# EAGLE design main-pcb-v3-r (EAGLE 9.6.2)
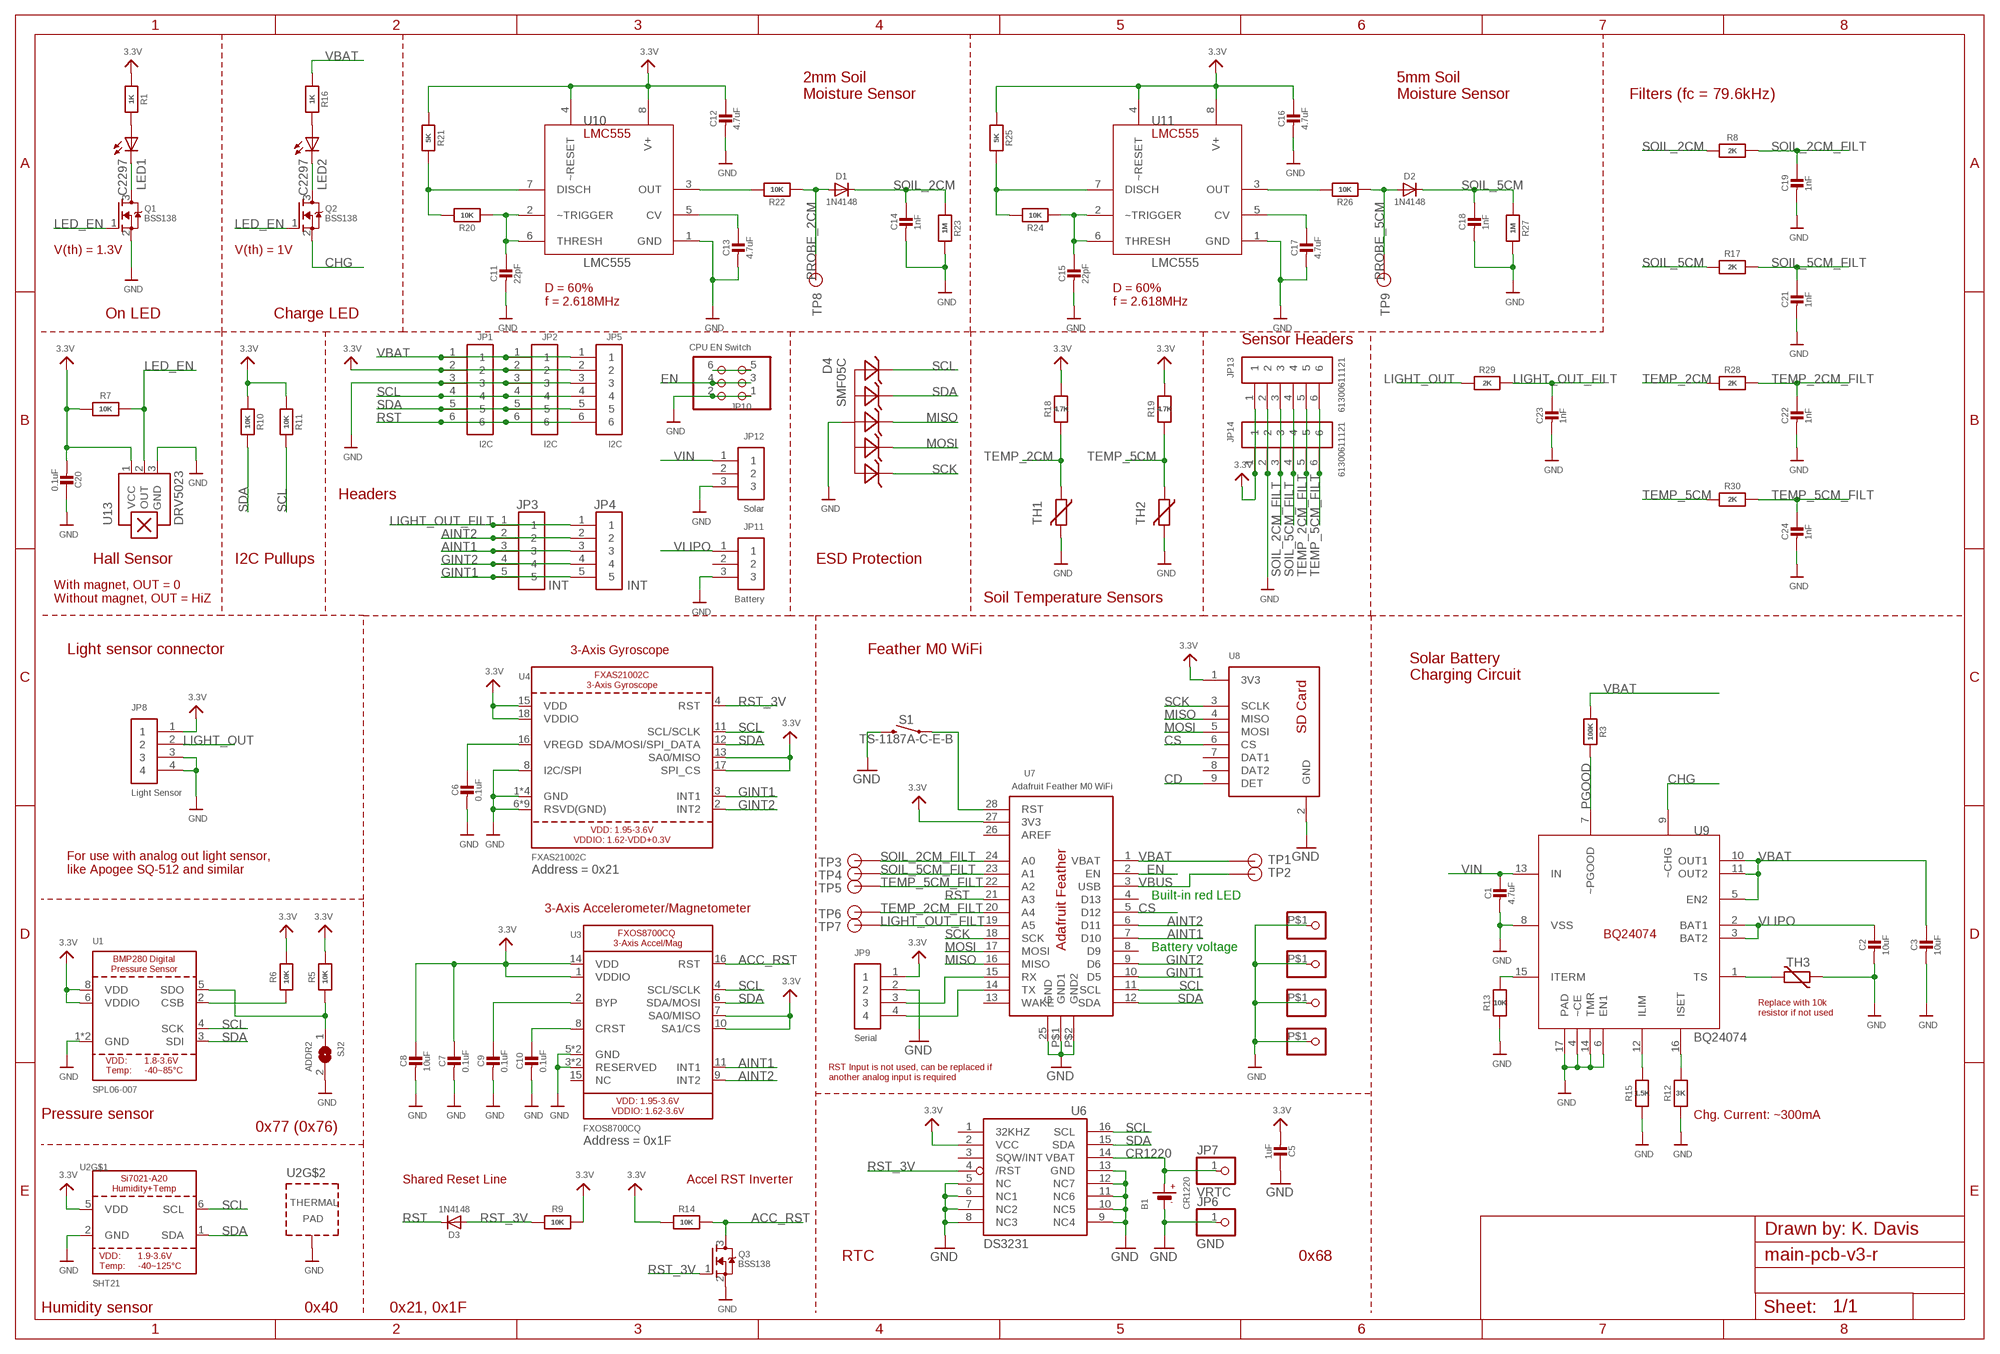
[diagram p0: schematic, sheet 1]

## Parts
B1  CR1220  BATTERYCR1220_2  [CR1220-2]
C1  4.7uF  CAP_CERAMIC0805-NOOUTLINE  [0805-NO]
C2  10uF  CAP_CERAMIC0805-NOOUTLINE  [0805-NO]
C3  10uF  CAP_CERAMIC0805-NOOUTLINE  [0805-NO]
C5  1uF  CAP_CERAMIC0805-NOOUTLINE  [0805-NO]
C6  0.1uF  CAP_CERAMIC0805-NOOUTLINE  [0805-NO]
C7  0.1uF  CAP_CERAMIC0805-NOOUTLINE  [0805-NO]
C8  10uF  CAP_CERAMIC0805-NOOUTLINE  [0805-NO]
C9  0.1uF  CAP_CERAMIC0805-NOOUTLINE  [0805-NO]
C10  0.1uF  CAP_CERAMIC0805-NOOUTLINE  [0805-NO]
C11  22pF  CAP_CERAMIC0805-NOOUTLINE  [0805-NO]
C12  4.7uF  CAP_CERAMIC0805-NOOUTLINE  [0805-NO]
C13  4.7uF  CAP_CERAMIC0805-NOOUTLINE  [0805-NO]
C14  1nF  CAP_CERAMIC0805-NOOUTLINE  [0805-NO]
C15  22pF  CAP_CERAMIC0805-NOOUTLINE  [0805-NO]
C16  4.7uF  CAP_CERAMIC0805-NOOUTLINE  [0805-NO]
C17  4.7uF  CAP_CERAMIC0805-NOOUTLINE  [0805-NO]
C18  1nF  CAP_CERAMIC0805-NOOUTLINE  [0805-NO]
C19  1nF  CAP_CERAMIC0805-NOOUTLINE  [0805-NO]
C20  0.1uF  CAP_CERAMIC0805-NOOUTLINE  [0805-NO]
C21  1nF  CAP_CERAMIC0805-NOOUTLINE  [0805-NO]
C22  1nF  CAP_CERAMIC0805-NOOUTLINE  [0805-NO]
C23  1nF  CAP_CERAMIC0805-NOOUTLINE  [0805-NO]
C24  1nF  CAP_CERAMIC0805-NOOUTLINE  [0805-NO]
D1  1N4148  DIODESOD-323  [SOD-323]
D2  1N4148  DIODESOD-323  [SOD-323]
D3  1N4148  DIODESOD-323  [SOD-323]
D4  SMF05C  [SC70-6]
JP1  I2C  61300611121  [61300611121]
JP2  I2C  61300611121  [61300611121]
JP3  INT  61300511121  [61300511121]
JP4  INT  61300511121  [61300511121]
JP5  I2C  61300611121  [61300611121]
JP6  GND  HEADER-1X1ROUND  [1X01_ROUND]
JP7  VRTC  HEADER-1X1ROUND  [1X01_ROUND]
JP8  Light Sensor  61300411121  [61300411121]
JP9  Serial  61300411121  [61300411121]
JP10  CPU EN Switch  PINHD-2X3  [2X03]
JP11  Battery  61300311121  [61300311121]
JP12  Solar  61300311121  [61300311121]
JP13  61300611121  [61300611121]
JP14  61300611121  [61300611121]
LED1  C2297  LEDCHIPLED_0805  [CHIPLED_0805]
LED2  C2297  LEDCHIPLED_0805  [CHIPLED_0805]
Q1  BSS138  MOSFET-NWIDE  [SOT23-WIDE]
Q2  BSS138  MOSFET-NWIDE  [SOT23-WIDE]
Q3  BSS138  MOSFET-NWIDE  [SOT23-WIDE]
R1  1K  RESISTOR_0603_NOOUT  [0603-NO]
R3  100K  RESISTOR_0603_NOOUT  [0603-NO]
R5  10K  RESISTOR_0603_NOOUT  [0603-NO]
R6  10K  RESISTOR_0603_NOOUT  [0603-NO]
R7  10K  RESISTOR_0603_NOOUT  [0603-NO]
R8  2K  RESISTOR_0603_NOOUT  [0603-NO]
R9  10K  RESISTOR0805_NOOUTLINE  [0805-NO]
R10  10K  RESISTOR_0603_NOOUT  [0603-NO]
R11  10K  RESISTOR_0603_NOOUT  [0603-NO]
R12  3K  RESISTOR0805_NOOUTLINE  [0805-NO]
R13  10K  RESISTOR0805_NOOUTLINE  [0805-NO]
R14  10K  RESISTOR0805_NOOUTLINE  [0805-NO]
R15  1.5K  RESISTOR0805_NOOUTLINE  [0805-NO]
R16  1K  RESISTOR_0603_NOOUT  [0603-NO]
R17  2K  RESISTOR_0603_NOOUT  [0603-NO]
R18  4.7K  RESISTOR0805_NOOUTLINE  [0805-NO]
R19  4.7K  RESISTOR0805_NOOUTLINE  [0805-NO]
R20  10K  RESISTOR0805_NOOUTLINE  [0805-NO]
R21  5K  RESISTOR0805_NOOUTLINE  [0805-NO]
R22  10K  RESISTOR0805_NOOUTLINE  [0805-NO]
R23  1M  RESISTOR0805_NOOUTLINE  [0805-NO]
R24  10K  RESISTOR0805_NOOUTLINE  [0805-NO]
R25  5K  RESISTOR0805_NOOUTLINE  [0805-NO]
R26  10K  RESISTOR0805_NOOUTLINE  [0805-NO]
R27  1M  RESISTOR0805_NOOUTLINE  [0805-NO]
R28  2K  RESISTOR_0603_NOOUT  [0603-NO]
R29  2K  RESISTOR_0603_NOOUT  [0603-NO]
R30  2K  RESISTOR_0603_NOOUT  [0603-NO]
S1  TS-1187A-C-E-B  MOMENTARY-SWITCH-SPST-SMD-5.2MM  [TACTILE_SWITCH_SMD_5.2MM]
SJ2  ADDR2  SOLDERJUMPER  [SOLDERJUMPER_ARROW_NOPASTE]
TH1  VARISTORCN1206  [CT/CN1206]
TH2  VARISTORCN1206  [CT/CN1206]
TH3  VARISTORCN1206  [CT/CN1206]
TP1  TP  [TP_50MIL_CIRC]
TP2  TP  [TP_50MIL_CIRC]
TP3  TP  [TP_50MIL_CIRC]
TP4  TP  [TP_50MIL_CIRC]
TP5  TP  [TP_50MIL_CIRC]
TP6  TP  [TP_50MIL_CIRC]
TP7  TP  [TP_50MIL_CIRC]
TP8  TP  [TP_50MIL_CIRC]
TP9  TP  [TP_50MIL_CIRC]
U1  SPL06-007  BMP280_COMBO  [BMX280_COMBO]
U2  SHT21  SI7021-A20  [DFN6_3X3_SI]
U3  FXOS8700CQ  ACCEL_MAG_FXOS8700CQ  [QFN16_3MM_FREESCALE_5X3]
U4  FXAS21002C  GYRO_FXAS21002C  [QFN24_4MM_FREESCALE_7X5]
U6  DS3231/SO  [SO16W]
U7  Adafruit Feather M0 WiFi  FEATHER  [FEATHER]
U8  SDCARD2  [SDCARD2]
U9  BQ24074  [VQFN-16_3MM]
U10  LMC555  [SOIC-8]
U11  LMC555  [SOIC-8]
U13  DRV5023  [SOT-23]
U$1  MOUNTING  [MOUNTING]
U$17  MOUNTING  [MOUNTING]
U$19  MOUNTING  [MOUNTING]
U$21  MOUNTING  [MOUNTING]

## Nets
3.3V: C5.2 C7.1 C8.1 C12.1 C16.1 C20.2 JP1.2 JP2.2 JP5.2 JP8.1 JP9.1 JP13.1 JP14.1 R1.1 R5.2 R6.2 R7.1 R9.2 R10.1 R11.1 R14.1 R18.2 R19.2 R21.1 R25.1 U1.6(VDDIO) U1.8(VDD) U2.5(VDD) U3.1(VDDIO) U3.7(SA0/MISO) U3.10(SA1/CS) U3.14(VDD) U4.13(SA0/MISO) U4.15(VDD) U4.17(SPI_CS) U4.18(VDDIO) U6.2(VCC) U7.27(3V3) U8.1(3V3) U10.4(~RESET) U10.8(V+) U11.4(~RESET) U11.8(V+) U13.1(VCC)
ACC_RST: Q3.3(D) R14.2 U3.16(RST)
AINT1: JP3.3 JP4.3 U3.11(INT1) U7.7(D10)
AINT2: JP3.2 JP4.2 U3.9(INT2) U7.6(D11)
CD: U8.9(DET)
CHG: Q2.2(S) U9.9(~CHG)
CR1220: B1.+ JP7.1 U6.14(VBAT)
CS: U7.5(D12) U8.6(CS)
EN: JP10.3 JP10.4 U7.2(EN)
GINT1: JP3.5 JP4.5 U4.3(INT1) U7.10(D5)
GINT2: JP3.4 JP4.4 U4.2(INT2) U7.9(D6)
GND: B1.- C1.2 C2.2 C3.2 C5.1 C6.2 C7.2 C8.2 C9.2 C10.2 C11.2 C12.2 C13.2 C14.2 C15.2 C16.2 C17.2 C18.2 C19.2 C20.1 C21.2 C22.2 C23.2 C24.2 D4.2(A) JP1.3 JP2.3 JP5.3 JP6.1 JP8.3 JP8.4 JP9.2 JP10.1 JP10.2 JP11.3 JP12.3 JP13.2 JP14.2 Q1.2(S) Q3.2(S) R12.1 R13.1 R15.1 R23.2 R27.2 S1.3 SJ2.2 TH1.2 TH2.2 TH3.2 U1.1(GND) U1.7(GND) U2.2(GND) U2.PAD(TP) U3.3(RESERVED) U3.5(GND) U3.12(GND) U3.13(RESERVED) U4.1(GND) U4.5(GND) U4.6(RSVD(GND)) U4.7(RSVD(GND)) U4.8(I2C/SPI) U4.9(RSVD(GND)) U4.10(RSVD(GND)) U4.14(GND) U4.19(GND) U4.20(RSVD(GND)) U4.21(RSVD(GND)) U4.22(RSVD(GND)) U4.23(RSVD(GND)) U4.24(RSVD(GND)) U6.5(NC) U6.6(NC1) U6.7(NC2) U6.8(NC3) U6.9(NC4) U6.10(NC5) U6.11(NC6) U6.12(NC7) U6.13(GND) U7.25(GND) U7.P$1(GND1) U7.P$2(GND2) U8.2(GND) U9.4(~CE) U9.6(EN1) U9.8(VSS) U9.14(TMR) U9.17(PAD) U10.1(GND) U11.1(GND) U13.3(GND) U$1.P$1 U$17.P$1 U$19.P$1 U$21.P$1
ITERM: R13.2 U9.15(ITERM)
LED1: LED1.C Q1.3(D)
LED2: LED2.C Q2.3(D)
LED_EN: Q1.1(G) Q2.1(G) R7.2 U13.2(OUT)
LIGHT_OUT: JP8.2 R29.1
LIGHT_OUT_FILT: C23.1 JP3.1 JP4.1 R29.2 TP7.1(TP) U7.19(A5)
MISO: D4.4(C3) U7.16(MISO) U8.4(MISO)
MOSI: D4.5(C4) U7.17(MOSI) U8.5(MOSI)
N$1: LED1.A R1.2
N$3: R6.1 U1.2(CSB)
N$4: R5.1 SJ2.1 U1.5(SDO)
N$5: JP9.3 U7.15(RX)
N$6: JP10.5 JP10.6
N$9: JP9.4 U7.14(TX)
N$10: TH3.1 U9.1(TS)
N$11: S1.1 U7.28(RST)
N$12: C11.1 R20.1 U10.2(~TRIGGER) U10.6(THRESH)
N$13: LED2.A R16.2
N$14: R20.2 R21.2 U10.7(DISCH)
N$15: C13.1 U10.5(CV)
N$16: C15.1 R24.1 U11.2(~TRIGGER) U11.6(THRESH)
N$17: R12.2 U9.16(ISET)
N$18: R15.2 U9.12(ILIM)
N$19: R24.2 R25.2 U11.7(DISCH)
N$20: R22.2 U10.3(OUT)
N$21: C17.1 U11.5(CV)
N$22: R26.2 U11.3(OUT)
N$24: C6.1 U4.16(VREGD)
N$26: C9.1 U3.2(BYP)
N$27: C10.1 U3.8(CRST)
PGOOD: R3.2 U9.7(~PGOOD)
PROBE_2CM: D1.A R22.1 TP8.1(TP)
PROBE_5CM: D2.A R26.1 TP9.1(TP)
RST: D3.C JP1.6 JP2.6 JP5.6 U7.21(A3)
RST_3V: D3.A Q3.1(G) R9.1 U4.4(RST) U6.4(/RST)
SCK: D4.6(C5) U7.18(SCK) U8.3(SCLK)
SCL: D4.1(C1) JP1.4 JP2.4 JP5.4 R11.2 U1.4(SCK) U2.6(SCL) U3.4(SCL/SCLK) U4.11(SCL/SCLK) U6.16(SCL) U7.11(SCL)
SDA: D4.3(C2) JP1.5 JP2.5 JP5.5 R10.2 U1.3(SDI) U2.1(SDA) U3.6(SDA/MOSI) U4.12(SDA/MOSI/SPI_DATA) U6.15(SDA) U7.12(SDA)
SOIL_2CM: C14.1 D1.C R8.1 R23.1
SOIL_2CM_FILT: C19.1 JP13.3 JP14.3 R8.2 TP3.1(TP) U7.24(A0)
SOIL_5CM: C18.1 D2.C R17.1 R27.1
SOIL_5CM_FILT: C21.1 JP13.4 JP14.4 R17.2 TP4.1(TP) U7.23(A1)
TEMP_2CM: R18.1 R28.1 TH1.1
TEMP_2CM_FILT: C22.1 JP13.5 JP14.5 R28.2 TP6.1(TP) U7.20(A4)
TEMP_5CM: R19.1 R30.1 TH2.1
TEMP_5CM_FILT: C24.1 JP13.6 JP14.6 R30.2 TP5.1(TP) U7.22(A2)
VBAT: C3.1 JP1.1 JP2.1 JP5.1 R3.1 R16.1 TP1.1(TP) U7.1(VBAT) U9.5(EN2) U9.10(OUT1) U9.11(OUT2)
VBUS: TP2.1(TP) U7.3(USB)
VIN: C1.1 JP12.1 U9.13(IN)
VLIPO: C2.1 JP11.1 U9.2(BAT1) U9.3(BAT2)
Unconnected: JP11.2 JP12.2 U3.15(NC) U6.1(32KHZ) U6.3(SQW/INT) U7.4(D13) U7.8(D9) U7.13(WAKE) U7.26(AREF) U8.7(DAT1) U8.8(DAT2)

## Notes on the sheet
- 2mm Soil
  Moisture Sensor
- 5mm Soil
  Moisture Sensor
- Filters (fc = 79.6kHz)
- V(th) = 1.3V | V(th) = 1V
- D = 60%
  f = 2.618MHz
- D = 60%
  f = 2.618MHz
- On LED | Charge LED
- Sensor Headers
- Headers
- Hall Sensor | I2C Pullups | ESD Protection
- With magnet, OUT = 0
  Without magnet, OUT = HiZ
- Soil Temperature Sensors
- Light sensor connector | 3-Axis Gyroscope | Feather M0 WiFi
- Solar Battery
  Charging Circuit
- For use with analog out light sensor,
  like Apogee SQ-512 and similar
- Address = 0x21
- Built-in red LED
- 3-Axis Accelerometer/Magnetometer
- Battery voltage
- Replace with 10k
  resistor if not used
- RST Input is not used, can be replaced if
  another analog input is required
- Pressure sensor | Chg. Current: ~300mA
- 0x77 (0x76)
- Address = 0x1F
- Shared Reset Line | Accel RST Inverter
- Drawn by: K. Davis
- RTC | 0x68
- Humidity sensor | 0x40 | 0x21, 0x1F

## Library data of the parts
B1 = microbuilder:BATTERY: CR1220 SMT - Digikey: 3001K-ND CD2032 BAT-HLD-001 - Digikey: BAT-HLD-001-ND
C1-C3 C5-C24 = microbuilder:CAP_CERAMIC: Ceramic Capacitors For new designs, use the packages preceded by an '_' character since they are more reliable: The following footprints should be used on most boards: _0402 - Standard footprint for regular board layouts _0603 - Standard footprint for regular board layouts _0805 - Standard footprint for regular board layouts _1206 - Standard footprint for regular board layouts For extremely tight-pitch boards where space is at a premium, the following 'micro-pitch' footprints can be used (smaller pads, no silkscreen outline, etc.): _0402MP - Micro-pitch footprint for very dense/compact boards _0603MP - Micro-pitch footprint for very dense/compact boards _0805MP - Micro-pitch footprint for very dense/compact boards _1206MP - Micro-pitch footprint for very dense/compact boards
D1-D3 = microbuilder:DIODE: Diode SMA Model Volts Amps Type Vf Ir Digikey # Notes SSA34-E3 40V 3A Schottky 480mV @ 3A 200uA @ 40V SSA34-E3/61TGITR-ND CDBA120-G 20V 1A Schottky 500mV @ 1A 500uA @ 20V 641-1014-6-ND REEL MBRA210 10V 2A Schottky 350mV @ 2A 700uA @ 10V MBRA210LT3 SOD-123 Model Volts Amps Type Vf Ir Order # Notes BAT54T1G 30V 200mA Schottky 800mV @ 200mA 2uA @ 25V BAT54T1GOSTR-ND B0530W 30V 500mA Schottky 430mV @ 500mA 130uA @ 30V B0530W-FDICT-ND REEL MBR120 20V 1A Schottky 340mV @ 1A MBR120VLSFT1GOSCT-ND SOD-323 Model Volts Amps Type Vf Ir Order # Notes PMEG2005EJ 20V 500mA Schottky 355mV @ 500mA 568-4110-1-ND ZLLS410 10V 570mA Schottky 380mV @ 570mA ZLLS410CT-ND 1N4148WS 75V 150mA Silicon/Simple 1V 1N4148WSFSCT-ND REEL SOD-523 Model Volts Amps Type Vf Ir Order # Notes BAT54XV2 30V 200mA Schottky 0.8V @ 100mA BAT54XV2CT-ND TB751S 30V 30mA Schottky RB751S-40TE61CT-ND SOT23-R/W (R = Solder Paste/Reflow Ovens, W = Hand-Soldering) Model Volts Amps Type Vf Ir Order # Notes BAT54FILM 40V 300mA Schottky 497-7162-1-ND POWERDI-5 Model Volts Amps Type Vf Ir Order # Notes PDS560 60V 5A Schottky 670mV @ 5A 150uA @ 60V PDS560DICT-ND
D4 = TVS-Diode-SMF05C:SMF05C; AVAILABILITY: Unavailable; MF: ON Semiconductor; MP: SMF05C; PACKAGE: SOT-363 ON Semiconductor; PRICE: None
JP1 JP2 JP5 JP13 JP14 = EarthPodLib:61300611121: CONN HEADER VERT 5POS 2.54MM Manufacturer's datasheet <https://katalog.we-online.de/em/datasheet/6130xx11121.pdf>; CREATED_BY: PCBLayout.com; DIGI_KEY_PART_NUMBER: 732-5318-ND; MANUFACTURER: Wurth Electronics Inc.; MPN: 61300511121
JP3 JP4 = Headers:61300511121: CONN HEADER VERT 5POS 2.54MM Manufacturer's datasheet <https://katalog.we-online.de/em/datasheet/6130xx11121.pdf>; CREATED_BY: PCBLayout.com; DIGI_KEY_PART_NUMBER: 732-5318-ND; MANUFACTURER: Wurth Electronics Inc.; MPN: 61300511121
JP6 JP7 = microbuilder:HEADER-1X1: PIN HEADER
JP8 JP9 = Headers:61300411121: CONN HEADER VERT 4POS 2.54MM Manufacturer's datasheet <https://katalog.we-online.de/em/datasheet/6130xx11121.pdf>; CREATED_BY: PCBLayout.com; DIGI_KEY_PART_NUMBER: 732-5317-ND; MANUFACTURER: Wurth Electronics Inc.; MPN: 61300411121
JP10 = pinhead:PINHD-2X3: PIN HEADER
JP11 JP12 = Headers:61300311121: CONN HEADER VERT 3POS 2.54MM Manufacturer's datasheet <https://katalog.we-online.de/em/datasheet/6130xx11121.pdf>; CREATED_BY: PCBLayout.com; DIGI_KEY_PART_NUMBER: 732-5316-ND; MANUFACTURER: Wurth Electronics Inc.; MPN: 61300311121
LED1 LED2 = adafruit:LED: LED OSRAM: - CHIPLED LG R971, LG N971, LY N971, LG Q971, LY Q971, LO R971, LY R971 LH N974, LH R974 LS Q976, LO Q976, LY Q976 LO Q996 - Hyper CHIPLED LW Q18S LB Q993, LB Q99A, LB R99A - SideLED LS A670, LO A670, LY A670, LG A670, LP A670 LB A673, LV A673, LT A673, LW A673 LH A674 LY A675 LS A676, LA A676, LO A676, LY A676, LW A676 LS A679, LY A679, LG A679 - Hyper Micro SIDELED® LS Y876, LA Y876, LO Y876, LY Y876 LT Y87S - SmartLED LW L88C, LW L88S LB L89C, LB L89S, LG L890 LS L89K, LO L89K, LY L89K LS L896, LA L896, LO L896, LY L896 - TOPLED LS T670, LO T670, LY T670, LG T670, LP T670 LSG T670, LSP T670, LSY T670, LOP T670, LYG T670 LG T671, LOG T671, LSG T671 LB T673, LV T673, LT T673, LW T673 LH T674 LS T676, LA T676, LO T676, LY T676, LB T676, LH T676, LSB T676, LW T676 LB T67C, LV T67C, LT T67C, LS T67K, LO T67K, LY T67K, LW E67C LS E67B, LA E67B, LO E67B, LY E67B, LB E67C, LV E67C, LT E67C LW T67C LS T679, LY T679, LG T679 LS T770, LO T770, LY T770, LG T770, LP T770 LB T773, LV T773, LT T773, LW T773 LH T774 LS E675, LA E675, LY E675, LS T675 LS T776, LA T776, LO T776, LY T776, LB T776 LHGB T686 LT T68C, LB T68C - Hyper Mini TOPLED® LB M676 - Mini TOPLED Santana® LG M470 LS M47K, LO M47K, LY M47K Source: http://www.osram.convergy.de/
Q1-Q3 = microbuilder:MOSFET-N: N-Channel Mosfet LEGEND VDS: Voltage Drain-Source ID: Drain Current RDS(ON): Drain-Source On-State Resistance VGS(TH): Gate-Source Threshold Voltage CISS: Drain-Source Input Capacitance SOT-23 Name VDS ID RDS(ON) VGS(TH) CISS Order Number 2N7002E 60V 260mA 2.5 Ohm 2.5V @ 250uA 26.7pF @ 25V 2N7002ET1GOSTR-ND BSH103 30V 850mA 400 mOhm 400mV @ 1mA 83pF @ 24V BSH103,235-ND BSS138 60V 320mA 1.6 Ohm 1.5V @ 250uA 50pF @ 10V Mouser: 771-BSS138PW115 DMN2075U-7 20V 4.2A 38 mOhm 1V @ 250 uA 594.3pF @ 10V DMN2075U-7DICT-ND * BSS138 good choice for I2C level-shifting POWERPAK 1212-8 Name VDS ID RDS(ON) VGS(TH) CISS Order Number Si7308DN 60V 6A 58 mOhm 3V @ 250uA 665pF @ 15V SI7308DN-T1-E3CT-ND
R1 R3 R5-R30 = microbuilder:RESISTOR: Resistors For new designs, use the packages preceded by an '_' character since they are more reliable: The following footprints should be used on most boards: _0402 - Standard footprint for regular board layouts _0603 - Standard footprint for regular board layouts _0805 - Standard footprint for regular board layouts _1206 - Standard footprint for regular board layouts For extremely tight-pitch boards where space is at a premium, the following 'micro-pitch' footprints can be used (smaller pads, no silkscreen outline, etc.): _0402MP - Micro-pitch footprint for very dense/compact boards _0603MP - Micro-pitch footprint for very dense/compact boards _0805MP - Micro-pitch footprint for very dense/compact boards _1206MP - Micro-pitch footprint for very dense/compact boards
S1 = SparkFun-Switches:MOMENTARY-SWITCH-SPST: Momentary Switch (Pushbutton) - SPST Normally-open (NO) SPST momentary switches (buttons, pushbuttons). Variants PTH-12MM - 12mm square, through-hole Momentary Pushbutton Switch - 12mm Square <https://www.sparkfun.com/products/9190> (COM-09190) PTH-6.0MM, PTH-6.0MM-KIT - 6.0mm square, through-hole Mini Pushbutton Switch <https://www.sparkfun.com/products/97> (COM-00097) KIT package intended for soldering kit's - only one side of pads' copper is exposed. PTH-RIGHT-ANGLE-KIT - Right-angle, through-hole Right Angle Tactile Button <https://www.sparkfun.com/products/10791> - Used on SparkFun BigTime Watch Kit <https://www.sparkfun.com/products/11734> SMD-12MM - 12mm square, surface-mount Tactile Button - SMD (12mm) <https://www.sparkfun.com/products/12993> (COM-12993) Used on SparkFun PicoBoard <https://www.sparkfun.com/products/11888> SMD-4.5MM - 4.5mm Square Trackball Switch Used on SparkFun Blackberry Trackballer Breakout <https://www.sparkfun.com/products/13169> SMD-4.6MMX2.8MM - 4.60mm x 2.80mm, surface mount Used on SparkFun SAMD21 Mini Breakout <https://www.sparkfun.com/products/13664> SMD-5.2MM, SMD-5.2-REDUNDANT - 5.2mm square, surface-mount Mini Pushbutton Switch - SMD <https://www.sparkfun.com/products/8720> (COM-08720) Used on Arduino Pro Mini <https://www.sparkfun.com/products/11114> REDUNDANT package connects both switch circuits together SMD-6.0X3.5MM - 6.0 x 3.5mm, surface mount Momentary Reset Switch SMD <https://www.sparkfun.com/products/8229> (COM-08229) SMD-6.2MM-TALL - 6.2mm square, surface mount Tactile Button - SMD (6mm) <https://www.sparkfun.com/products/12992> Used on SparkFun Digital Sandbox <https://www.sparkfun.com/products/12651> SMD-RIGHT-ANGLE - Right-angle, surface mount Used on SparkFun Block for Intel® Edison - Arduino <https://www.sparkfun.com/products/13036>; PROD_ID: SWCH-08247; SF_SKU: COM-08720
SJ2 = microbuilder:SOLDERJUMPER: SMD Solder JUMPER Solder the two pads together to create a connection, or remove the solder to break it. REFLOW - Use this footprint for solder paste and reflow ovens. WAVE - Use this footprint for hand-soldering (larger pads). CLOSED - Has a trace between the two pads to ensure it is closed by default. The trace needs to be cut to disable the jumper, and can be closed again by creating a solder bridge between the two pads.; BOM: EXCLUDE
TH1-TH3 = varistor:VARISTOR: VARISTOR
TP1-TP9 = EarthPodLib:TP
U1 = adafruit_sensor:BMP280: BMP280 - Digital Pressure Sensor Operating Pressure Range: 300-1100 hPa Pressure Resolution: 0.16Pa RMS Noise: 1.3Pa Temperature Resolution: 0.01 C
U2 = microbuilder:SI7021-A20: Si7021-A20 - I2C Humidity and Temperature Sensor VDD: 1.9-3.6V Operating Temperature: -40~125°C +/-3% RH (max) 0..80% RH Humidity Sensor +/-0.4°C (max-, -10~85°C Temperature Sensor 150uA Active, 60nA Standby
U3 = microbuilder:ACCEL_MAG_FXOS8700CQ: FX0S8700CQ - 3-Axis Accelerometer and Magnetometer Accel Range: +/-2/4/8 g Accel Data Rate: 1.6-800Hz (400Hz in hybrid mode) Accel Resolution: 14-bits Mag Range: 1200uT Mag Data Rate: 1.6-800Hz (400Hz in hybrid mode) Mag Resolution: 16-bits
U4 = microbuilder:GYRO_FXAS21002C: FXAS21002C - 3 Axis Gyroscope - 250/500/1000/2000dps Range: 250/500/1000/2000 dps Data Rate: 2.5-800Hz Resolution: 16-bits
U6 = adafruit:DS3231
U7 = Breakout-Boards:FEATHER
U8 = Breakout-Boards:SDCARD2
U9 = EarthPodLib:BQ24074
U10 U11 = EarthPodLib:LMC555
U13 = EarthPodLib:DRV5023: Unipolar Hall Effect Sensor (South)
U$1 U$17 U$19 U$21 = Breakout-Boards:MOUNTING

## Net classes
1 highpower: width 0.305 mm, drill 0.483 mm
2 lowpower: width 0.254 mm, drill 0.483 mm

## Board
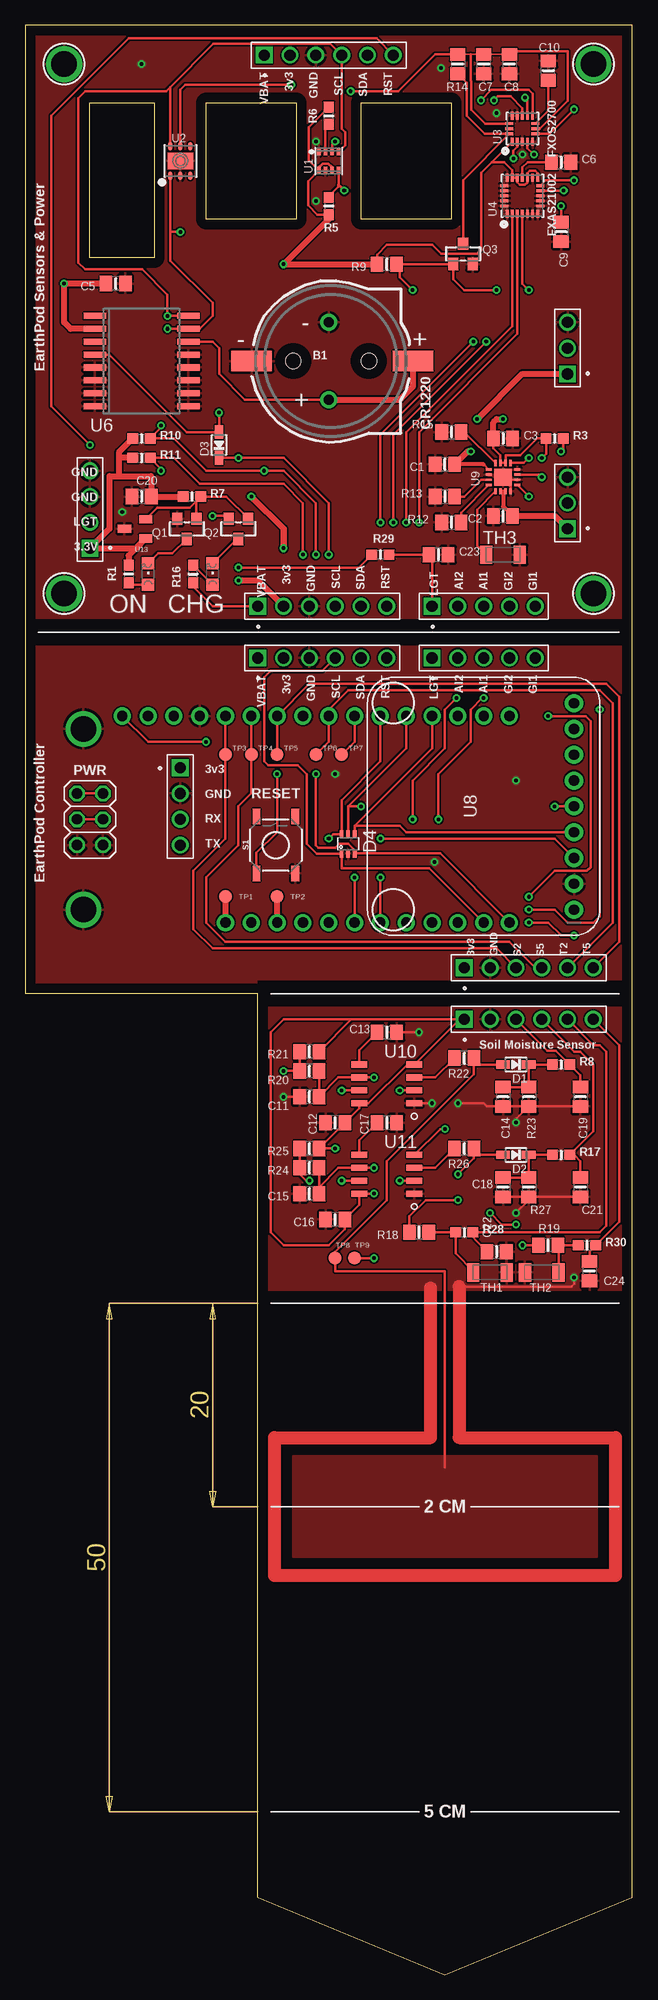
[diagram p1: board, top side]
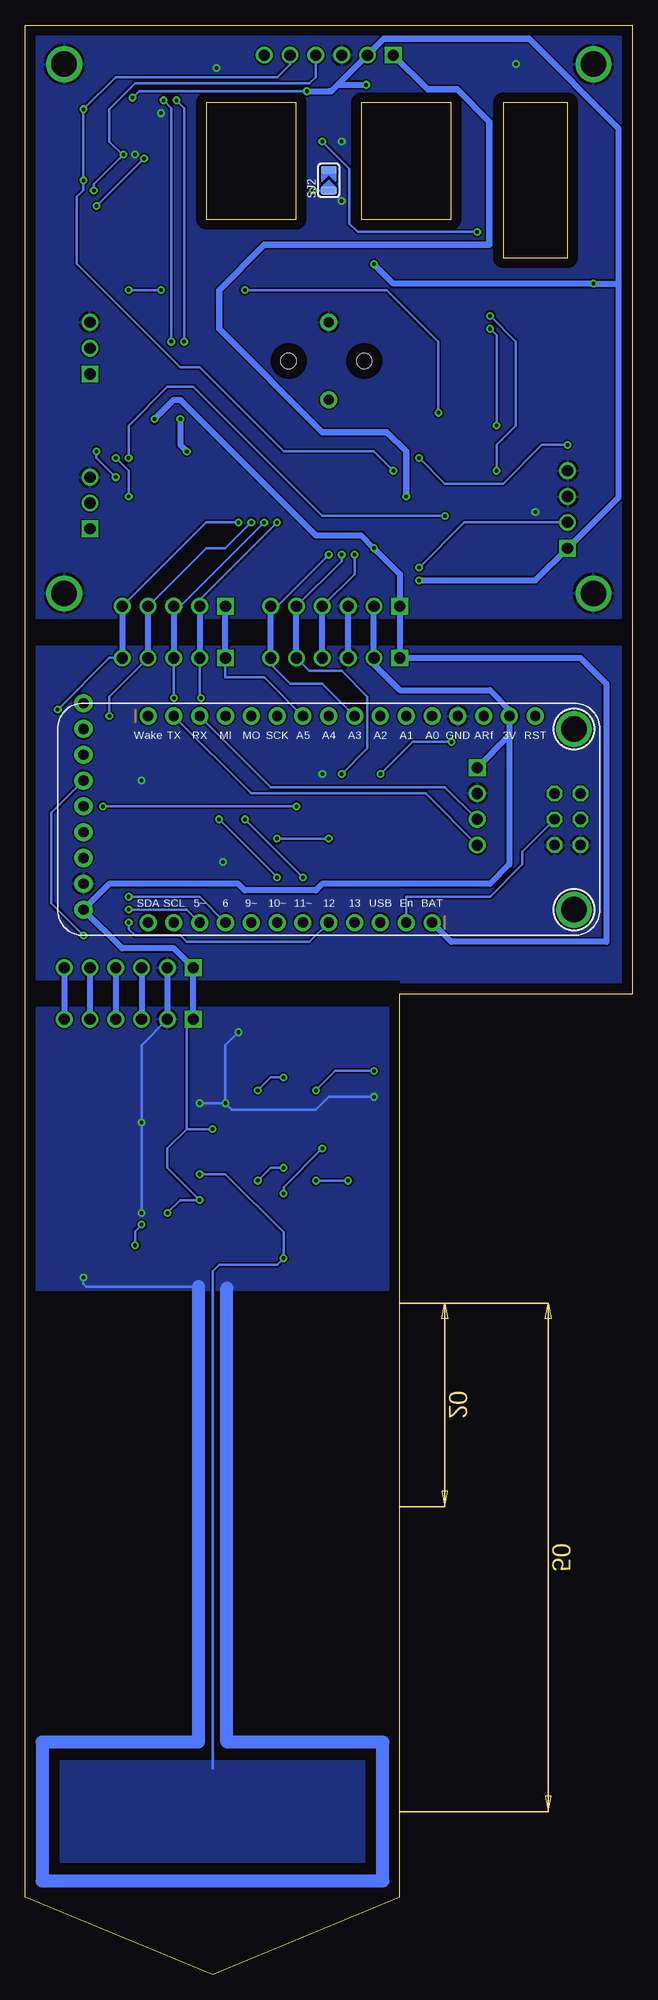
[diagram p2: board, bottom side, seen from below]

Size 59.69 x 191.77 mm. Coordinates in mm from the lower left corner, seen from the top.
Outline: 59.69,7.62 59.69,191.77 0,191.77 0,96.52 22.86,96.52 22.86,7.62 41.27,0 59.69,7.62
Outline: 6.35,184.15 12.7,184.15 12.7,168.91 6.35,168.91 6.35,184.15
Outline: 26.67,184.15 26.67,172.72 17.78,172.72 17.78,184.15 26.67,184.15
Outline: 33.02,184.15 41.91,184.15 41.91,172.72 33.02,172.72 33.02,184.15
Copper layers (1*16): Top 0.035mm / dielectric 1.5mm / Bottom 0.035mm
Design rules "default": minimum track width 6mil, minimum drill 0.35mm, track to track 6mil, track to pad 6mil, pad to pad 6mil, via to via 6mil, smd to smd 6mil, copper to edge 40mil, drill to drill 6mil, minimum pad ring 10mil, minimum via ring 8mil, stop-mask expansion 4mil, vias tented up to drill 0mil, thermal gap 10mil
tRestrict: area 0,130.8 to 59.7,133.4; area 22.9,95.2 to 59.7,97.8
bRestrict: area 0,130.8 to 59.7,133.4; area 22.9,95.2 to 59.7,97.8

### Footprints (pad centres in the part's own frame; a part is rotated, then mirrored left to right if it is on the bottom)
CR1220-2 = smd 4 x 2: + 8.29,0; - -7.6,0 | hole 1.5: 3.95,0; -3.5,0
0805-NO = smd 1.24 x 1.5: 1 -0.95,0; 2 0.95,0
SOD-323 = smd 1.35 x 0.8: A 1.27,0; C -1.27,0
SC70-6 = smd 0.35 x 0.8: 1 -0.65,-0.95; 2 0,-0.95; 3 0.65,-0.95; 4 0.65,0.95; 5 0,0.95; 6 -0.65,0.95
61300611121 = drill 1.1 square: 1 -6.35,0 | drill 1.1: 2 -3.81,0; 3 -1.27,0; 4 1.27,0; 5 3.81,0; 6 6.35,0
61300511121 = drill 1.1 square: 1 -5.08,0 | drill 1.1: 2 -2.54,0; 3 0,0; 4 2.54,0; 5 5.08,0
1X01_ROUND = drill 1 pad 1.676: 1 0,0
61300411121 = drill 1.1 square: 1 -3.81,0 | drill 1.1: 2 -1.27,0; 3 1.27,0; 4 3.81,0
2X03 = drill 1.016 octagon: 1 -2.54,-1.27; 2 -2.54,1.27; 3 0,-1.27; 4 0,1.27; 5 2.54,-1.27; 6 2.54,1.27
61300311121 = drill 1.1 square: 1 -2.54,0 | drill 1.1: 2 0,0; 3 2.54,0
CHIPLED_0805 = smd 1.2 x 1.2: A 0,-1.05; C 0,1.05
SOT23-WIDE = smd 1 x 1.2: 1 -0.95,-1; 2 0.95,-1; 3 0,1
0603-NO = smd 1.075 x 1: 1 -0.85,0; 2 0.85,0
TACTILE_SWITCH_SMD_5.2MM = smd 1.524 x 0.762: 1 -2.794,1.905; 2 2.794,1.905; 3 -2.794,-1.905; 4 2.794,-1.905
SOLDERJUMPER_ARROW_NOPASTE = smd 0.762 x 1.524: 1 -1.016,0; 2 1.016,0
CT/CN1206 = smd 1.2 x 1.8: 1 -1.65,0; 2 1.65,0
TP_50MIL_CIRC = smd 1.27 x 1.27: 1 0,0
BMX280_COMBO = smd 0.725 x 0.35: 1 0.925,0.975; 2 0.925,0.325; 3 0.925,-0.325; 4 0.925,-0.975; 5 -0.925,-0.975; 6 -0.925,-0.325; 7 -0.925,0.325; 8 -0.925,0.975
DFN6_3X3_SI = smd 0.85 x 0.45: 1 -1.45,1; 2 -1.45,0; 3 -1.45,-1; 4 1.45,-1; 5 1.45,0; 6 1.45,1 | smd 1.6 x 2.5: PAD 0,0
QFN16_3MM_FREESCALE_5X3 = smd 0.8 x 0.275: 1 -1.275,1; 2 -1.275,0.5; 3 -1.275,0; 4 -1.275,-0.5; 5 -1.275,-1; 9 1.275,-1; 10 1.275,-0.5; 11 1.275,0; 12 1.275,0.5; 13 1.275,1 | smd 0.275 x 0.8: 6 -0.5,-1.275; 7 0,-1.275; 8 0.5,-1.275; 14 0.5,1.275; 15 0,1.275; 16 -0.5,1.275
QFN24_4MM_FREESCALE_7X5 = smd 0.8 x 0.275: 1 -1.775,1.5; 2 -1.775,1; 3 -1.775,0.5; 4 -1.775,0; 5 -1.775,-0.5; 6 -1.775,-1; 7 -1.775,-1.5; 13 1.775,-1.5; 14 1.775,-1; 15 1.775,-0.5; 16 1.775,0; 17 1.775,0.5; 18 1.775,1; 19 1.775,1.5 | smd 0.275 x 0.8: 8 -1,-1.775; 9 -0.5,-1.775; 10 0,-1.775; 11 0.5,-1.775; 12 1,-1.775; 20 1,1.775; 21 0.5,1.775; 22 0,1.775; 23 -0.5,1.775; 24 -1,1.775
SO16W = smd 0.6 x 2.2: 1 -4.445,-4.6; 2 -3.175,-4.6; 3 -1.905,-4.6; 4 -0.635,-4.6; 5 0.635,-4.6; 6 1.905,-4.6; 7 3.175,-4.6; 8 4.445,-4.6; 9 4.445,4.6; 10 3.175,4.6; 11 1.905,4.6; 12 0.635,4.6; 13 -0.635,4.6; 14 -1.905,4.6; 15 -3.175,4.6; 16 -4.445,4.6
FEATHER = drill 1 pad 1.676: 1 -8.89,10.16; 2 -6.35,10.16; 3 -3.81,10.16; 4 -1.27,10.16; 5 1.27,10.16; 6 3.81,10.16; 7 6.35,10.16; 8 8.89,10.16; 9 11.43,10.16; 10 13.97,10.16; 11 16.51,10.16; 12 19.05,10.16; 13 19.05,-10.16; 14 16.51,-10.16; 15 13.97,-10.16; 16 11.43,-10.16; 17 8.89,-10.16; 18 6.35,-10.16; 19 3.81,-10.16; 20 1.27,-10.16; 21 -1.27,-10.16; 22 -3.81,-10.16; 23 -6.35,-10.16; 24 -8.89,-10.16; 25 -11.43,-10.16; 26 -13.97,-10.16; 27 -16.51,-10.16; 28 -19.05,-10.16 | drill 2.5 pad 3.2: P$1 -22.86,8.89; P$2 -22.86,-8.89
SDCARD2 = drill 1 pad 1.778: 1 -10.16,0; 2 -7.62,0; 3 -5.08,0; 4 -2.54,0; 5 0,0; 6 2.54,0; 7 5.08,0; 8 7.62,0; 9 10.16,0
VQFN-16_3MM = smd 0.6 x 0.24: 1 -1.4,0.75; 2 -1.4,0.25; 3 -1.4,-0.25; 4 -1.4,-0.75; 9 1.4,-0.75; 10 1.4,-0.25; 11 1.4,0.25; 12 1.4,0.75 | smd 0.24 x 0.6: 5 -0.75,-1.4; 6 -0.25,-1.4; 7 0.25,-1.4; 8 0.75,-1.4; 13 0.75,1.4; 14 0.25,1.4; 15 -0.25,1.4; 16 -0.75,1.4 | smd 1.68 x 1.68: 17 0,0
SOIC-8 = smd 1.549 x 0.61: 1 -2.705,1.905; 2 -2.705,0.635; 3 -2.705,-0.635; 4 -2.705,-1.905; 5 2.705,-1.905; 6 2.705,-0.635; 7 2.705,0.635; 8 2.705,1.905
SOT-23 = smd 1.3 x 0.8: 1 -1.05,0.95; 2 -1.05,-0.95; 3 1.05,0
MOUNTING = drill 2.5 pad 3.2: P$1 0,0

### Placement (x,y rotation side)
B1  29.84,158.75 0 top
C1  41.27,148.59 180 top
C2  46.99,143.51 180 top
C3  46.99,151.13 0 top
C5  8.89,166.37 180 top
C6  52.7,178.31 0 top
C7  45.09,187.96 270 top
C8  47.62,187.96 270 top
C9  52.7,171.45 270 top
C10  51.44,187.32 90 top
C11  27.94,86.36 180 top
C12  30.48,83.82 180 top
C13  35.56,92.71 0 top
C14  46.99,86.36 270 top
C15  27.94,76.84 180 top
C16  30.48,74.3 180 top
C17  35.56,83.82 0 top
C18  46.99,77.47 270 top
C19  54.61,86.36 270 top
C20  11.43,145.42 0 top
C21  54.61,77.47 270 top
C22  46.35,71.12 0 top
C23  40.64,139.7 0 top
C24  55.5,69.22 270 top
D1  48.26,89.54 180 top
D2  48.26,80.65 180 top
D3  19.05,150.5 90 top
D4  31.75,111.25 0 top
JP1  29.21,129.54 0 top
JP2  29.21,134.62 0 top
JP3  45.09,129.54 0 top
JP4  45.09,134.62 0 top
JP5  29.84,188.85 0 top
JP6  29.84,162.56 0 top
JP7  29.84,154.94 0 top
JP8  6.35,144.15 90 top
JP9  15.24,114.94 270 top
JP10  6.35,113.67 90 top
JP11  53.34,144.78 90 top
JP12  53.34,160.02 90 top
JP13  49.53,99.06 0 top
JP14  49.53,93.98 0 top
LED1  12.06,137.8 0 top
LED2  18.41,137.8 0 top
Q1  15.88,142.24 180 top
Q2  20.95,142.24 180 top
Q3  43.05,169.29 0 top
R1  10.16,137.8 270 top
R3  52.07,151.13 0 top
R5  29.84,173.99 270 top
R6  29.84,182.88 90 top
R7  16.38,145.42 0 top
R8  52.7,89.54 0 top
R9  35.56,168.28 180 top
R10  11.43,151.13 0 top
R11  11.43,149.23 0 top
R12  41.91,142.88 0 top
R13  41.27,145.42 0 top
R14  42.55,187.96 270 top
R15  41.91,151.76 0 top
R16  16.51,137.8 90 top
R17  52.7,80.65 0 top
R18  38.73,73.03 180 top
R19  51.44,71.76 180 top
R20  27.94,88.9 180 top
R21  27.94,90.81 180 top
R22  43.18,90.17 180 top
R23  49.53,86.36 270 top
R24  27.94,79.38 180 top
R25  27.94,81.28 180 top
R26  43.18,81.28 180 top
R27  49.53,77.47 270 top
R28  43.18,73.03 0 top
R29  34.92,139.7 0 top
R30  55.24,71.76 0 top
S1  24.64,111.12 90 top
SJ2  29.84,176.53 90 bottom
TH1  45.72,69.09 0 top
TH2  50.8,69.09 180 top
TH3  46.99,139.7 0 top
TP1  19.68,106.05 0 top
TP2  24.77,106.05 0 top
TP3  19.68,120.02 0 top
TP4  22.23,120.02 0 top
TP5  24.77,120.02 0 top
TP6  28.57,120.02 0 top
TP7  31.11,120.02 0 top
TP8  30.48,70.49 0 top
TP9  32.38,70.49 0 top
U1  29.84,178.44 90 top
U2  15.24,178.44 90 top
U3  48.9,181.61 90 top
U4  48.9,175.01 90 top
U6  11.43,158.75 270 top
U7  28.57,113.67 180 bottom
U8  53.98,114.94 90 top
U9  46.99,147.32 90 top
U10  35.56,87.63 180 top
U11  35.56,78.74 180 top
U13  10.79,142.24 180 top
U$1  55.88,135.89 0 top
U$17  3.81,135.89 0 top
U$19  55.88,187.96 0 top
U$21  3.81,187.96 0 top

### Tracks (layer width: path | path; a pad name or v marks a point on that pad's centre or on a via)
3.3V  (via drill 0.35)
  Top 0.152: R14.1 43.81,188.91 C7.1 C8.1
  Top 0.229: 27.88,181.74 27.88,179.32 | 29.15,178.05 29.14,178.06 | U1.8 27.81,176.45 27.81,174.05 28.73,173.14 R5.2
  Top 0.254: R18.2 37.78,74.62 39.37,76.2 v42.55,76.2 | v48.26,73.79 46.86,73.79 v45.72,74.93 | R19.2 v48.9,71.76 | v30.48,81.28 R25.1 C12.1 32.85,85.25 U10.8 33.74,85.73 37.55,89.54 U10.4 42.71,93.98 JP14.1 32.06,93.98 | v34.29,76.84 U11.8 32.85,75.72 C16.1 31.43,73.34 29.84,71.76 25.4,71.76 24.13,73.03 24.13,92.71 25.4,93.98 32.06,93.98 | R21.1 32.06,93.98 | U11.4 40.8,83.19 v41.27,83.19 | U3.10 49.4,184.41 v49.15,184.66 | U2.5 15.24,185.42 15.75,185.93 v26.16,185.93 | C8.1 47.95,189.23 53.34,189.23 53.34,184.35 50.6,181.61 U3.7 | U3.14 45.22,182.11 43.84,183.49 43.84,186.29 43.81,186.31 43.81,188.91 | 49.4,177.21 49.35,177.17 49.35,176.3 49.15,176.1 48.64,176.1 48.4,176.35 U4.17 U4.18 47.9,177.53 47.13,178.3 45.86,178.3 | U4.13 50.4,177.21 50.15,177.46 49.64,177.46 49.4,177.21 | U4.15 49.4,177.21 | U3.1 45.86,178.3 | 45.86,178.3 44.83,177.27 44.83,169.67 44.45,169.29 40.89,169.29 40.01,170.18 35.56,170.18 34.61,169.23 R9.2 | R14.1 40.32,188.91 36.7,185.29 v32,185.29 | R6.2 29.84,183.71 27.88,181.74 | U1.6 30.17,177.79 29.81,178.15 29.23,178.15 29.14,178.06 28.87,177.79 U1.8 27.88,178.5 27.88,179.32
  Top 0.61: R7.1 C20.2 12.38,147.42 9.21,147.42 | v20.95,137.16 22.86,137.16 JP2.2 | 9.21,147.42 8.26,147.42 8.26,142.24 JP8.1 10.89,140.34 U13.1 10.16,139.61 R1.1 | C5.2 v3.81,166.37 3.81,162.56 4.45,161.93 U6.2 | R10.1 9.21,149.75 9.21,149.23 | 9.21,149.23 9.21,147.42 | R11.1 9.21,149.23 | R9.2 v25.4,168.28 29.84,172.72 R5.2
  Bottom 0.254: JP14.1 43.81,93.34 43.81,83.19 | v48.9,71.76 48.9,73.15 v48.26,73.79 | v45.72,74.93 44.45,76.2 v42.55,76.2 45.72,79.38 45.72,81.28 43.81,83.19 | v30.48,81.28 34.29,77.47 v34.29,76.84 | v41.27,83.19 43.81,83.19 | v49.15,184.66 48.51,185.29 v32,185.29
  Bottom 0.61: JP14.1 JP13.1 45.09,100.97 50.16,100.97 U8.1 51.44,107.31 38.73,107.31 38.1,106.68 31.11,106.68 30.48,107.31 13.97,107.31 12.06,109.22 12.06,121.92 | JP2.2 JP1.2 25.4,128.91 22.86,126.37 13.97,126.37 12.06,124.46 U7.27 12.06,121.92 | 12.06,121.92 JP9.1 | v20.95,137.16 9.53,137.16 JP8.1 1.32,145.36 1.32,166.37 | 10.13,190.44 1.32,181.62 1.32,166.37 | 1.32,166.37 v3.81,166.37 23.5,166.37 v25.4,168.28 | v32,185.29 29.84,185.29 | 29.59,185.29 28.96,185.93 v26.16,185.93
  Bottom 0.635: 10.13,190.44 24.45,190.44 JP5.2 29.59,185.29 29.84,185.29
ACC_RST
  Top 0.254: Q3.3 43.05,176.54 U3.16 45.2,181.11 43.43,182.88 43.43,186.12 R14.2
AINT1  (via drill 0.35)
  Top 0.254: U7.7 v34.92,107.95 | v40.64,113.67 40.64,118.11 43.81,121.28 43.81,124.46 44.96,125.6 v45.09,125.6 | v36.2,142.88 36.2,151.51 v45.34,160.66 | v46.1,184.4 46.48,184.79 47.75,184.79 48.9,183.64 U3.11
  Bottom 0.254: JP4.3 44.45,134.62 v36.2,142.88 | v40.64,113.67 v34.92,107.95 | JP3.3 v45.09,125.6 | v46.1,184.4 45.34,183.64 v45.34,160.66
  Bottom 0.61: JP4.3 JP3.3
AINT2  (via drill 0.35)
  Top 0.254: U7.6 v32.38,107.95 | v38.1,113.67 38.1,117.48 41.27,120.65 41.27,124.46 v42.42,125.6 | v34.92,142.88 34.92,151.51 v44.07,160.66 | v44.83,184.4 45.85,185.42 49.53,185.42 49.9,185.06 U3.9
  Bottom 0.254: JP4.2 42.55,135.25 v34.92,142.88 | v32.38,107.95 v38.1,113.67 | JP3.2 42.55,125.73 v42.42,125.6 | v44.83,184.4 44.07,183.64 v44.07,160.66
  Bottom 0.61: JP4.2 JP3.2
CHG  (via drill 0.35)
  Top 0.254: U9.9 49.02,148.72 v49.53,149.23 | v18.41,143.51 19.73,143.51 Q2.2
  Bottom 0.254: v18.41,143.51 30.48,143.51 43.18,156.21 45.72,156.21 49.53,152.4 v49.53,149.23
CR1220
  Top 0.254: U6.14 18.41,160.66 19.05,160.02 19.05,157.48 21.59,154.94 JP7.1
  Top 0.61: JP7.1 36.83,154.94 38.13,156.25 B1.+
CS  (via drill 0.35)
  Top 0.254: v49.53,103.51 51.44,103.51 52.7,102.24 v53.98,102.24
  Bottom 0.254: U7.5 31.75,101.6 43.81,101.6 44.45,102.24 48.9,102.24 49.53,102.87 v49.53,103.51 | v53.98,102.24 57.15,105.41 57.15,114.3 U8.6
EN
  Top 0.254: JP10.3 JP10.4
  Bottom 0.254: U7.2 22.23,106.05 13.97,106.05 10.79,109.22 10.79,110.49 JP10.3
GINT1  (via drill 0.35)
  Top 0.254: v49.53,104.78 52.07,104.78 53.34,103.51 55.88,103.51 56.52,104.14 v56.52,124.46 | v38.73,142.88 38.73,151.76 48.4,161.43 U4.3
  Bottom 0.254: JP4.5 41.91,142.88 v38.73,142.88 | U7.10 43.81,104.78 v49.53,104.78 | JP3.5 51.44,129.54 v56.52,124.46
  Bottom 0.61: JP4.5 JP3.5
GINT2  (via drill 0.35)
  Top 0.254: v49.53,106.05 52.07,108.59 55.24,108.59 55.63,108.97 55.63,123.32 55.12,123.83 v51.44,123.83 | v37.47,142.88 37.47,151.76 47.9,162.19 U4.2
  Bottom 0.254: JP4.4 41.91,140.34 40.01,140.34 v37.47,142.88 | U7.9 42.55,106.05 v49.53,106.05 | JP3.4 51.44,125.73 v51.44,123.83
  Bottom 0.61: JP3.4 JP4.4
GND  (via drill 0.35)
  Top 0.254: C18.2 R27.2 | R27.2 C21.2 | R23.2 C14.2 45.4,85.41 45.09,85.73 v42.55,85.73 | R23.2 C19.2 | v48.26,83.82 48.26,84.14 R23.2 | R27.2 49.53,76.2 v48.26,74.93 | U10.1 v40.01,85.73 | C13.2 v38.73,92.71 | v25.4,86.36 C11.2 | U9.6 47.24,147.07 U9.17 46.99,147.07 47.74,146.32 U9.4 | v53.98,68.58 53.98,67.95 53.72,67.69 42.67,67.69
  Top 1.27: 39.88,67.56 39.88,52.83 24.51,52.83 24.51,39.24 58.04,39.24 58.04,52.83 42.67,52.83 42.67,67.69
  Bottom 0.254: v48.26,74.93 v48.26,83.82 48.26,91.44 JP14.2 | v38.73,92.71 40.01,91.44 v40.01,85.73 | v25.4,86.36 29.84,86.36 31.11,85.09 39.37,85.09 v40.01,85.73 | v40.01,85.73 v42.55,85.73 | v53.98,68.58 53.98,67.95 53.72,67.69 42.67,67.69
  Bottom 0.61: JP13.2 JP14.2 | JP1.3 JP2.3
  Bottom 1.27: 42.67,67.69 42.67,22.86 58.04,22.86 58.04,9.22 24.51,9.22 24.51,22.86 39.88,22.86 39.88,67.56
  other vias: 9.53,143.89 28.57,174.5 48.9,179.07 46.35,183.13 28.57,180.34 40.26,109.47 48.26,117.48 30.48,118.11 11.43,187.96 40.89,187.58
  pour Top: -1.27,67.31 60.96,67.31 60.96,193.04 -1.27,193.04
  pour Bottom: -2.54,67.31 62.23,67.31 62.23,194.31 -2.54,194.31
ITERM
  Top 0.254: U9.15 44.84,147.07 43.18,145.42 R13.2
LED1
  Top 0.254: Q1.3 14.47,139.84 13.05,139.84 LED1.C
LED2
  Top 0.254: LED2.C 20.81,141.24 Q2.3
LED_EN
  Top 0.254: R7.2 19.78,145.42 21.91,143.29 Q2.1 | U13.2 12.99,144.33 16.15,144.33 R7.2 | Q1.1 16.82,145.01 R7.2
LIGHT_OUT  (via drill 0.35)
  Top 0.254: R29.1 32.8,138.43 v20.95,138.43
  Bottom 0.254: JP8.2 16.51,142.88 v20.95,138.43
LIGHT_OUT_FILT
  Top 0.254: TP7.1 32.38,121.28 U7.19 | JP4.1 40.01,139.38 C23.1 R29.2
  Bottom 0.254: U7.19 36.2,127.64 40.01,127.64 JP3.1
  Bottom 0.61: JP3.1 JP4.1
MISO
  Top 0.254: D4.4 32.4,113.03 | 32.4,113.03 32.4,113.05 40.01,120.65 U7.16 | U8.4 37.47,112.4 36.83,113.03 32.4,113.03
MOSI  (via drill 0.35)
  Top 0.254: D4.5 31.75,114.94 | 31.75,114.94 37.47,120.65 U7.17 | v33.02,114.94 31.75,114.94 | U8.5 v52.07,114.94
  Bottom 0.254: v33.02,114.94 v52.07,114.94
N$1
  Top 0.254: LED1.A 10.36,136.75 R1.2
N$3
  Top 0.254: U1.2 29.52,181.71 R6.1
N$4  (via drill 0.35)
  Top 0.229: 30.8,175.9 30.8,176.09 31.05,175.83 v31.37,175.51
  Top 0.254: R5.1 29.84,174.94 30.8,175.9 | 31.05,175.83 30.82,176.06 U1.5
  Bottom 0.254: SJ2.1 v31.37,175.51
N$5
  Bottom 0.254: JP9.3 18.41,116.84 35.56,116.84 U7.15
N$6
  Top 0.254: JP10.6 JP10.5
N$9
  Bottom 0.254: JP9.4 20.32,116.21 37.47,116.21 U7.14
N$10
  Top 0.254: U9.1 44.45,144.13 44.45,140.59 TH3.1
N$11  (via drill 0.35)
  Top 0.254: v24.77,118.11 24.77,112.4 22.73,110.36 S1.1 | v17.78,121.28 12.06,121.28 U7.28
  Bottom 0.254: v17.78,121.28 21.59,121.28 v24.77,118.11
N$12  (via drill 0.35)
  Top 0.254: v34.29,88.27 U10.6 30.8,88.27 C11.1 R20.1 | v36.83,87 U10.2
  Bottom 0.254: v34.29,88.27 35.56,88.27 v36.83,87
N$13
  Top 0.254: R16.2 LED2.A
N$14  (via drill 0.35)
  Top 0.254: R21.2 R20.2 v25.4,88.9 | U10.7 v31.11,87
  Bottom 0.254: v25.4,88.9 29.21,88.9 v31.11,87
N$15
  Top 0.254: C13.1 32.85,90.96 U10.5
N$16  (via drill 0.35)
  Top 0.254: v34.29,79.38 U11.6 30.8,79.38 28.89,77.47 C15.1 R24.1 | v36.83,78.11 U11.2
  Bottom 0.254: v34.29,79.38 35.56,79.38 v36.83,78.11
N$17
  Top 0.254: U9.16 42.86,143.84 R12.2
N$18
  Top 0.254: R15.2 43.2,151.76 U9.12
N$19  (via drill 0.35)
  Top 0.254: R25.2 R24.2 26.99,78.74 27.62,78.11 v27.94,78.11 | v31.11,78.11 U11.7
  Bottom 0.254: v31.11,78.11 v27.94,78.11
N$20
  Top 0.254: R22.2 40.33,88.27 U10.3
N$21
  Top 0.254: U11.5 32.85,82.06 C17.1
N$22
  Top 0.254: R26.2 40.33,79.38 U11.3
N$24
  Top 0.254: C6.1 49.4,178.31 48.9,177.8 U4.16
N$26  (via drill 0.35)
  Top 0.254: U3.2 48.4,179.84 48.01,179.45 v48.01,178.69 | C9.1 v52.7,173.99
  Bottom 0.254: v48.01,178.69 v52.7,173.99
N$27
  Top 0.254: U3.8 51.44,183.38 C10.1
PGOOD  (via drill 0.35)
  Top 0.254: U9.7 50.55,147.57 v50.8,147.32 | v52.7,149.86 52.92,150.07 R3.2
  Bottom 0.254: v50.8,147.32 52.7,149.23 v52.7,149.86
PROBE_2CM
  Top 0.254: D1.A 44.77,89.54 R22.1 44.13,88.58 35.56,80.01 35.56,76.2 30.48,71.12 TP8.1 30.48,69.22 41.27,69.22 41.27,49.91
  pour Top: 26.29,51.04 56.26,51.04 56.26,41.04 26.29,41.04
PROBE_5CM  (via drill 0.35)
  Top 0.254: TP9.1 v34.29,70.49 | v42.55,78.74 44.13,80.33 R26.1 44.77,80.65 D2.A
  Bottom 0.254: 41.27,20.32 41.27,69.22 40.64,69.85 34.92,69.85 v34.29,70.49 34.29,73.03 40.01,78.74 v42.55,78.74
  pour Bottom: 26.29,21.04 56.26,21.04 56.26,11.04 26.29,11.04
RST  (via drill 0.35)
  Top 0.254: v29.84,139.7 29.84,144.78 25.4,149.23 v20.95,149.23 D3.C | v6.35,150.5 2.54,154.31 2.54,182.88 10.16,190.5 34.54,190.5 JP5.6
  Bottom 0.254: U7.21 30.48,127 33.66,127 35.56,128.91 JP1.6 | v29.84,139.7 34.92,134.62 JP2.6 | v6.35,150.5 8.89,150.5 12.7,146.69 18.41,146.69 v20.95,149.23
  Bottom 0.61: JP1.6 JP2.6
RST_3V  (via drill 0.35)
  Top 0.254: R9.1 36.53,168.29 36.83,168.29 | 36.83,168.29 Q3.1 42.1,166.81 43.18,165.74 v46.35,165.74 | v49.53,165.74 48.9,166.37 U4.4 | U6.4 8.26,159.38 15.88,151.76 D3.A v19.05,153.67 | v38.1,165.74 36.83,167 36.83,168.29
  Bottom 0.254: v46.35,165.74 v49.53,165.74 | v19.05,153.67 19.05,160.66 24.13,165.74 v38.1,165.74
SCK  (via drill 0.35)
  Top 0.254: U7.18 34.92,119.38 31.1,115.56 D4.6 30.29,112.2 v29.84,111.76 | v34.92,111.76 52.07,111.76 U8.3
  Bottom 0.254: v34.92,111.76 v29.84,111.76
SCL  (via drill 0.35)
  Top 0.254: D4.1 31.11,110.29 | 31.11,110.29 31.11,108.84 39.75,108.84 U7.11 | JP1.4 29.21,128.27 24.13,128.27 23.5,127.64 23.5,119.38 23.88,119 26.8,119 27.69,118.11 27.69,111.25 28.65,110.29 31.11,110.29 | U2.6 14.24,185.69 | 14.24,185.69 18.5,189.95 30.01,189.95 JP5.4 31.11,181.61 31.45,181.27 31.45,180 U1.4 | v27.3,139.7 27.3,144.78 25.4,146.69 17.14,146.69 14.61,149.23 R11.2 13.34,148.17 v13.34,147.96 | U6.16 v13.97,163.19 13.97,165.28 11.48,167.77 5.88,167.77 5.21,168.44 5.21,184.62 5.88,185.29 13.84,185.29 14.24,185.69 | U3.4 49.4,179.7 50.02,179.07 v50.04,179.07 | v52.96,175.51 v52.95,175.51 U4.11
  Bottom 0.254: JP2.4 27.3,137.8 v27.3,139.7 | v13.34,147.96 13.34,150.5 11.43,152.4 11.43,160.66 v13.97,163.19 | v52.96,175.51 52.96,176.15 v50.04,179.07 50.16,179.07 51.44,180.34 51.44,183.51 48.9,186.06 31.75,186.06 31.11,186.69 JP5.4
  Bottom 0.61: JP1.4 JP2.4
SDA  (via drill 0.35)
  Top 0.254: U7.12 40.83,110.3 D4.3 32.4,110.62 31.77,111.25 30.86,111.25 30.48,110.87 28.83,110.87 28.57,111.12 v28.57,118.11 | v28.57,139.7 28.57,144.78 25.4,147.96 v23.5,147.96 17.78,147.96 14.61,151.13 R10.2 13.34,152.19 v13.34,152.4 | v13.97,161.93 U6.15 17.14,161.93 18.41,163.19 18.41,164.47 14.24,168.64 14.24,171.45 | U2.1 14.24,171.45 | v53.98,183.51 51.57,181.11 U3.6 | U4.12 51.19,176.53 v53.98,176.53 | v15.24,171.45 14.24,171.45 | v30.48,180.34 30.17,180.03 U1.3
  Bottom 0.254: JP1.5 31.75,128.27 28.57,128.27 26.04,125.73 26.04,120.65 v28.57,118.11 | v28.57,139.7 28.57,139.06 JP2.5 | v13.34,152.4 13.34,161.29 v13.97,161.93 | v30.48,180.34 27.81,177.67 27.81,172.25 27.02,171.45 v15.24,171.45 | v23.5,147.96 25.4,149.86 34.29,149.86 42.55,158.12 44.45,158.12 54.63,168.3 54.63,174.9 53.98,175.56 v53.98,176.53 v53.98,183.51 50.8,186.69 34.92,186.69 33.66,187.96 JP5.5
  Bottom 0.61: JP1.5 JP2.5
SOIL_2CM
  Top 0.254: C14.1 R23.1 D1.C R8.1
SOIL_2CM_FILT
  Top 0.152: 54.61,88.48 53.77,89.33 R8.2 52.19,90.9 | 54.61,87.63 C19.1
  Top 0.254: JP14.3 51.34,90.9 52.19,90.9 53.77,89.33 | R8.2 54.61,88.48 54.61,87.63 | U7.24 TP3.1 19.68,111.76 16.51,108.59 16.51,102.87 18.41,100.97 46.35,100.97 JP13.3
  Bottom 0.61: JP13.3 JP14.3
SOIL_5CM
  Top 0.254: R17.1 D2.C R27.1 C18.1
SOIL_5CM_FILT
  Top 0.254: C21.1 54.61,80.01 53.98,80.65 R17.2 55.88,82.97 55.88,89.54 54.61,90.81 53.98,90.81 JP14.4 | U7.23 TP4.1 22.23,116.21 20.95,114.94 20.95,111.12 17.78,107.95 17.78,103.51 19.68,101.6 47.62,101.6 50.16,99.06 JP13.4
  Bottom 0.61: JP13.4 JP14.4
TEMP_2CM
  Top 0.254: R18.1 R28.1 42.33,70.95 44.07,69.21 TH1.1
TEMP_2CM_FILT
  Top 0.254: C22.1 43.81,72.81 R28.2 56.52,73.03 57.15,73.66 57.15,90.81 56.52,91.44 55.88,91.44 JP14.5 | TP6.1 29.84,121.28 U7.20 29.84,124.46 31.75,126.37 56.52,126.37 57.78,125.09 57.78,103.51 JP13.5
  Bottom 0.61: JP13.5 JP14.5
TEMP_5CM
  Top 0.254: TH2.1 52.45,71.69 R19.1 R30.1
TEMP_5CM_FILT
  Top 0.254: C24.1 55.5,71.16 R30.2 58.42,74.08 58.42,91.44 JP14.6 | JP13.6 58.42,101.6 58.42,125.73 57.15,127 27.94,127 U7.22 TP5.1
  Bottom 0.61: JP13.6 JP14.6
VBAT  (via drill 0.35)
  Top 0.254: C3.1 46.04,150.18 46.74,149.48 U9.11 U9.10 47.24,149.47 48.68,149.47 50.34,151.13 R3.1 51.22,149.65 v50.8,149.23 | JP2.1 18.41,134.62 16.51,136.53 R16.1 | U9.5 v49.53,145.43 v49.53,145.42
  Top 0.61: C3.1 46.04,152.72 46.36,153.04 v46.99,153.04 | TP1.1 U7.1
  Top 0.635: v22.23,145.42 25.4,142.24 v25.4,140.34
  Bottom 0.254: v49.53,145.42 49.53,147.96 v50.8,149.23
  Bottom 0.61: v46.99,153.04 45.09,154.94 44.45,154.94 31.11,141.61 26.67,141.61 v25.4,140.34 22.86,137.8 JP2.1 JP1.1 5.08,129.54 2.54,127 2.54,101.6 17.78,101.6 U7.1
  Bottom 0.635: JP5.1 20.13,185.48 17.23,185.48 14.03,182.29 14.03,170.18 36.2,170.18 40.64,165.74 40.64,161.93 30.48,151.76 24.13,151.76 22.23,149.86 v22.23,145.42
VBUS
  Top 0.61: U7.3 TP2.1
VIN  (via drill 0.35)
  Top 0.254: U9.13 45.07,148.59
  Top 0.406: 45.07,148.59 C1.1
  Top 0.61: v43.81,149.86 43.49,149.86 C1.1 | v44.45,153.04 48.9,157.48 JP12.1
  Bottom 0.61: v43.81,149.86 44.45,150.5 v44.45,153.04
VLIPO
  Top 0.254: U9.2 46.99,145.92 U9.3 U9.2
  Top 0.406: C2.1 46.99,144.46 46.99,145.92
  Top 0.61: C2.1 52.07,143.51 JP11.1

### Text on the board
tNames: VBAT / / 3v3 / / GND / / SCL / / SDA / / RST | FXOS2700 | FXAS21002 | EarthPod Sensors & Power | - | - | + | + | CR1220 | GND / / GND / / LGT / / 3.3V | VBAT / / 3v3 / / GND / / SCL / / SDA / / RST | LGT / / AI2 / / AI1 / / GI2 / / GI1 | ON | CHG | VBAT / / 3v3 / / GND / / SCL / / SDA / / RST | LGT / / AI2 / / AI1 / / GI2 / / GI1 | PWR | RESET | 3v3 / / GND / / RX / / TX | EarthPod Controller | 3v3 / / GND / / S2 / / S5 / / T2 / / T5 | Soil Moisture Sensor | 2 CM | 5 CM